# EAGLE design communication_shield (EAGLE 9.6.2)
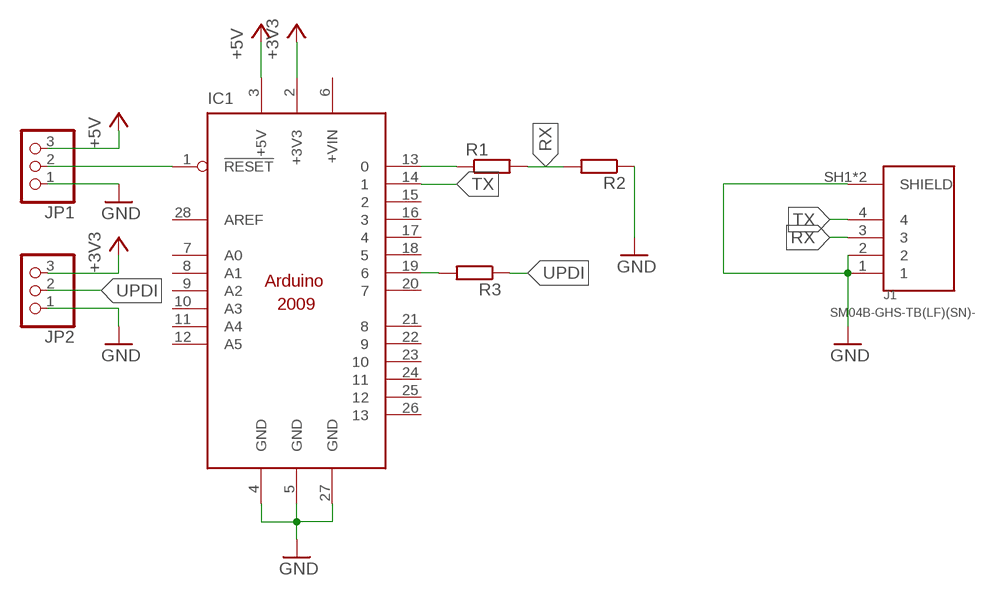
[diagram p0: schematic, sheet 1]

## Parts
IC1  ARDUINO2009_10  [ARDUINO2009]
J1  SM04B-GHS-TB(LF)(SN)-  [JST_SM04B-GHS-TB(LF)(SN)-]
JP1  PINHD-1X3  [1X03]
JP2  PINHD-1X3  [1X03]
R1  R-EU_0204/7  [0204/7]
R2  R-EU_0204/7  [0204/7]
R3  R-EU_0204/7  [0204/7]

## Nets
+3V3: IC1.2(+3V3) JP2.3
+5V: IC1.3(+5V) JP1.3
GND: IC1.4(GND) IC1.5(GND) IC1.27(GND) J1.1 J1.2 J1.SH1(SHIELD) J1.SH2(SHIELD) JP1.1 JP2.1 R2.1
N$1: IC1.19 R3.2
N$2: IC1.13 R1.1
N$6: IC1.1(!RESET) JP1.2
RX: J1.3 R1.2 R2.2
TX: IC1.14 J1.4
UPDI: JP2.2 R3.1
Unconnected: IC1.6(+VIN) IC1.7(A0) IC1.8(A1) IC1.9(A2) IC1.10(A3) IC1.11(A4) IC1.12(A5) IC1.15 IC1.16 IC1.17 IC1.18 IC1.20 IC1.21 IC1.22 IC1.23 IC1.24 IC1.25 IC1.26 IC1.28(AREF)

## Library data of the parts
IC1 = arduino:ARDUINO2009_1: The Arduino Duemilanove ("2009") is a microcontroller board based on the ATmega168 or ATmega328. - 14 digital input/output pins (of which 6 can be used as PWM outputs) - 6 analog inputs, a 16 MHz crystal oscillator - USB connection - power jack - ISP header - reset button It contains everything needed to support the microcontroller; simply connect it to a computer with a USB cable or power it with a AC-to-DC adapter or battery to get started http://arduino.cc/en/Main/ArduinoBoardDuemilanove
J1 = PUTRocketLab_connectors:SM04B-GHS-TB(LF)(SN)-: Conn Header Gh Side 4pos 1.25mm; DESCRIPTION: Connector Header Surface Mount, Right Angle 4 position 0.049 (1.25mm); DIGI-KEY_PART_NUMBER: 455-1566-6-ND; MF: JST Sales; MP: SM04B-GHS-TB(LF)(SN)-; PACKAGE: None; PURCHASE-URL: https://pricing.snapeda.com/search/part/SM04B-GHS-TB(LF)(SN)-/?ref=eda
JP1 JP2 = pinhead:PINHD-1X3: PIN HEADER
R1-R3 = rcl:R-EU_: RESISTOR, European symbol; SPICEPREFIX: R

## Board
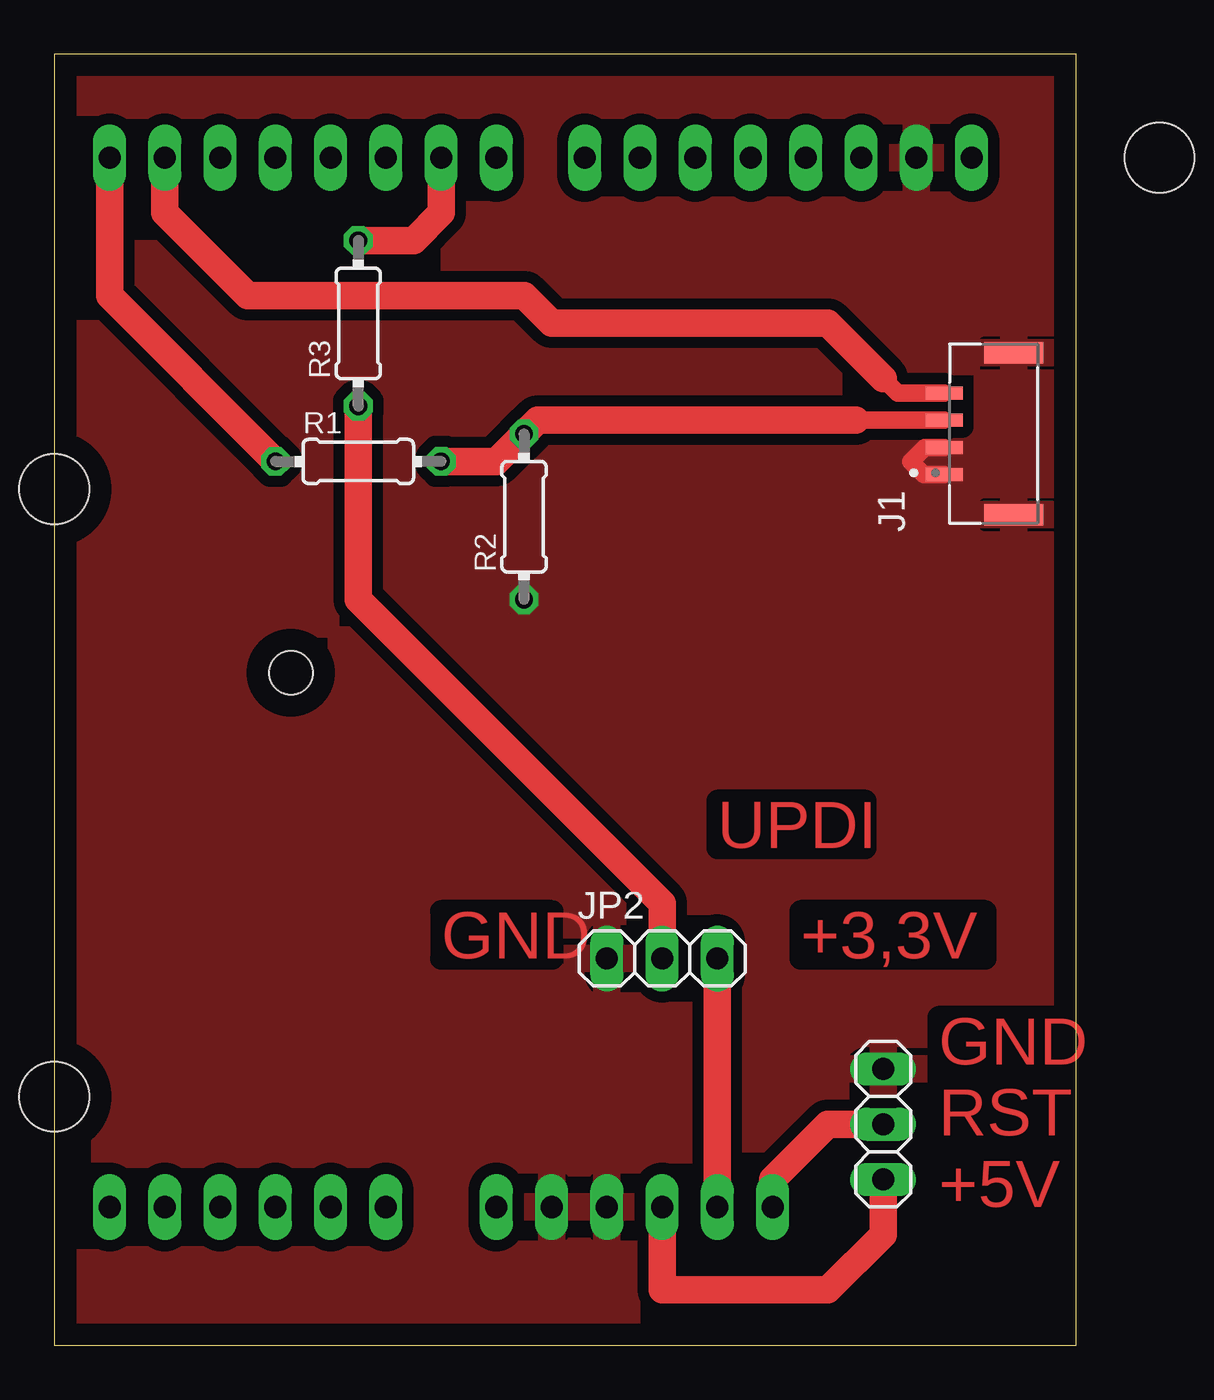
[diagram p1: board, top side]
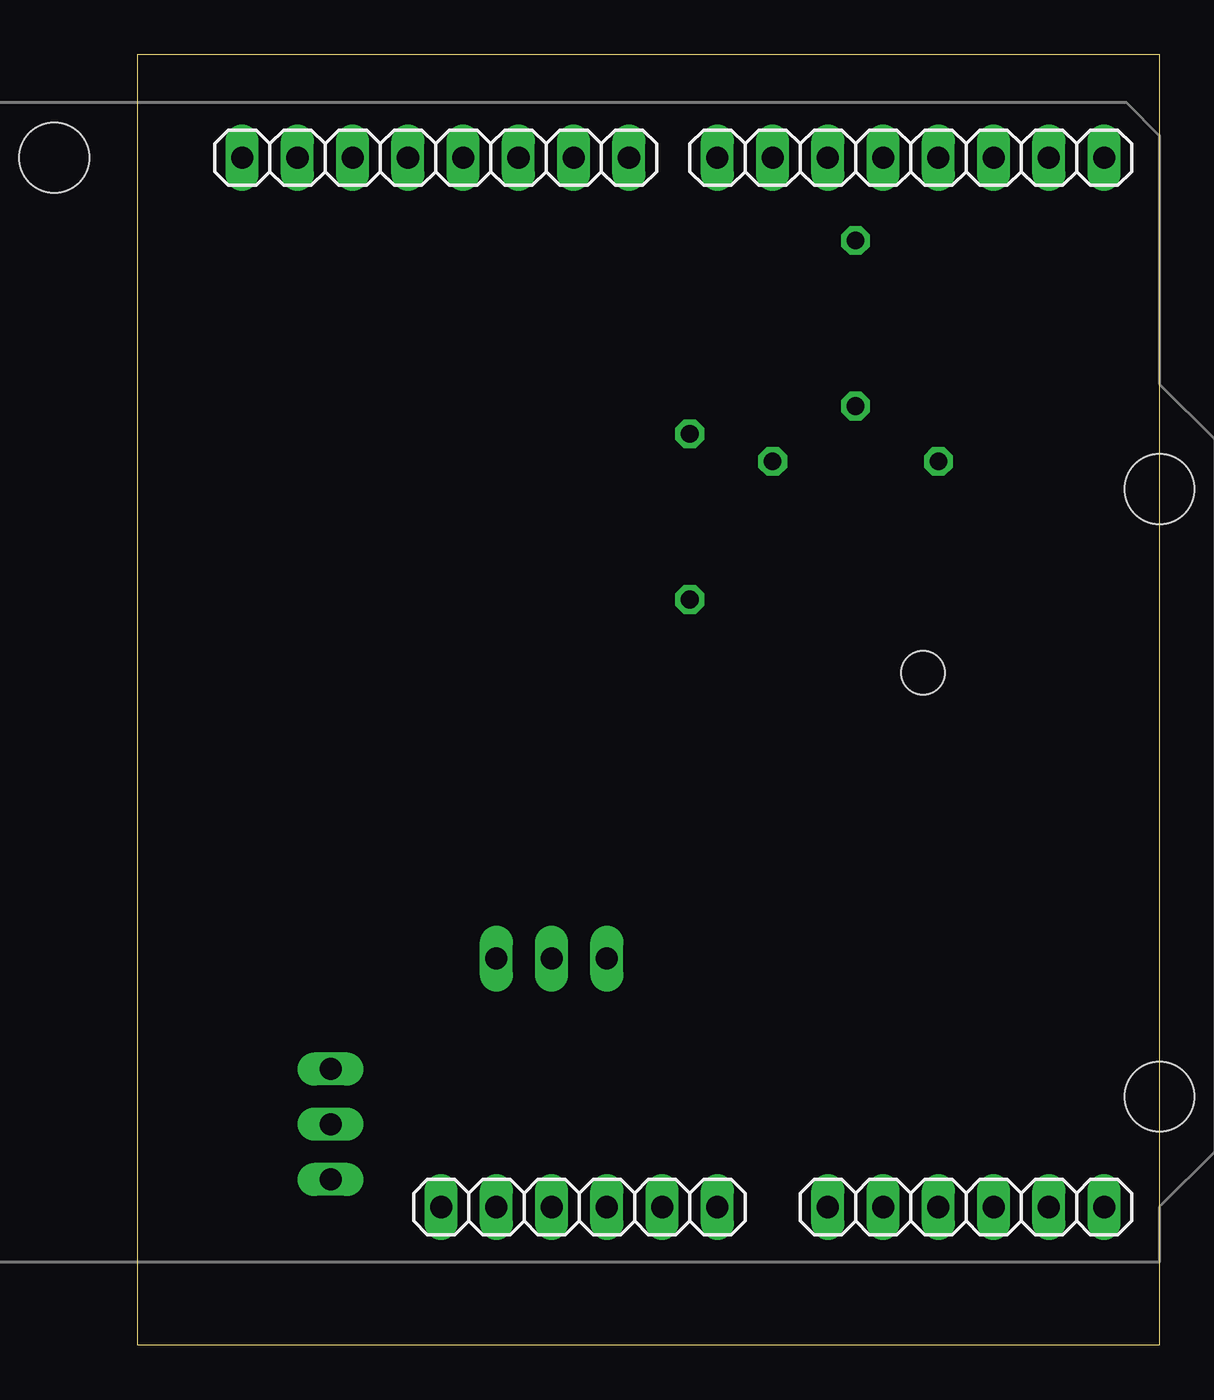
[diagram p2: board, bottom side, seen from below]

Size 46.97 x 59.36 mm. Coordinates in mm from the lower left corner, seen from the top.
Outline: 0,0 46.97,0 46.97,59.36 0,59.36 0,0
Copper layers (1*16): Top 0.035mm / dielectric 1.5mm / Bottom 0.035mm
Design rules "default": minimum track width 6mil, minimum drill 0.35mm, track to track 6mil, track to pad 6mil, pad to pad 6mil, via to via 6mil, smd to smd 6mil, copper to edge 40mil, drill to drill 6mil, minimum pad ring 10mil, minimum via ring 8mil, stop-mask expansion 4mil, vias tented up to drill 0mil, thermal gap 10mil

### Footprints (pad centres in the part's own frame; a part is rotated, then mirrored left to right if it is on the bottom)
ARDUINO2009 = drill 1.016 long: 1 33.02,2.54; 2 35.56,2.54; 3 38.1,2.54; 4 40.64,2.54; 5 43.18,2.54; 6 45.72,2.54; 7 50.8,2.54; 8 53.34,2.54; 9 55.88,2.54; 10 58.42,2.54; 11 60.96,2.54; 12 63.5,2.54; 13 63.5,50.8; 14 60.96,50.8; 15 58.42,50.8; 16 55.88,50.8; 17 53.34,50.8; 18 50.8,50.8; 19 48.26,50.8; 20 45.72,50.8; 21 41.656,50.8; 22 39.116,50.8; 23 36.576,50.8; 24 34.036,50.8; 25 31.496,50.8; 26 28.956,50.8; 27 26.416,50.8; 28 23.876,50.8 | hole 3.2: 15.24,50.8; 66.04,35.56; 66.04,7.62 | hole 2: 55.17,27.114
JST_SM04B-GHS-TB(LF)(SN)- = smd 0.6 x 1.7: 1 -1.875,2.275; 2 -0.625,2.275; 3 0.625,2.275; 4 1.875,2.275 | smd 1 x 2.7: SH1 -3.725,-0.925; SH2 3.725,-0.925
1X03 = drill 1.016 long: 1 -2.54,0; 2 0,0; 3 2.54,0
0204/7 = drill 0.813 octagon: 1 -3.81,0; 2 3.81,0

### Placement (x,y rotation side)
IC1  66.04,3.81 0 bottom
J1  43.18,41.91 90 top
JP1  38.1,10.16 270 top
JP2  27.94,17.78 0 top
R1  13.97,40.64 0 top
R2  21.59,38.1 90 top
R3  13.97,46.99 90 top

### Tracks (layer width: path | path; a pad name or v marks a point on that pad's centre or on a via)
+3V3
  Top 1.27: JP2.3 IC1.2
+5V
  Top 1.27: JP1.3 38.1,5.08 35.56,2.54 27.94,2.54 IC1.3
GND
  Top 0.813: J1.2 40.02,41.28 39.37,40.64 39.98,40.03 J1.1
  pour Top (isolate 0.508): -1.27,59.69 -1.27,0 46.99,0 46.99,59.69
N$1
  Top 1.27: R3.2 16.51,50.8 17.78,52.07 IC1.19
N$2
  Top 1.27: IC1.13 2.54,48.26 R1.1
N$6
  Top 1.27: IC1.1 33.02,7.62 35.56,10.16 JP1.2
RX
  Top 0.813: J1.3 36.83,42.53
  Top 1.27: R1.2 20.32,40.64 R2.2 22.22,42.53 36.83,42.53
TX
  Top 0.813: J1.4 38.77,43.78 38.1,44.45
  Top 1.27: 38.1,44.45 35.56,46.99 22.86,46.99 21.59,48.26 8.89,48.26 5.08,52.07 IC1.14
UPDI
  Top 1.27: JP2.2 27.94,20.32 13.97,34.29 R3.1

### Text on the board
Top: UPDI | GND | +3,3V | GND / RST / +5V